# Altium schematic sheet Analog.SchDoc
size A3
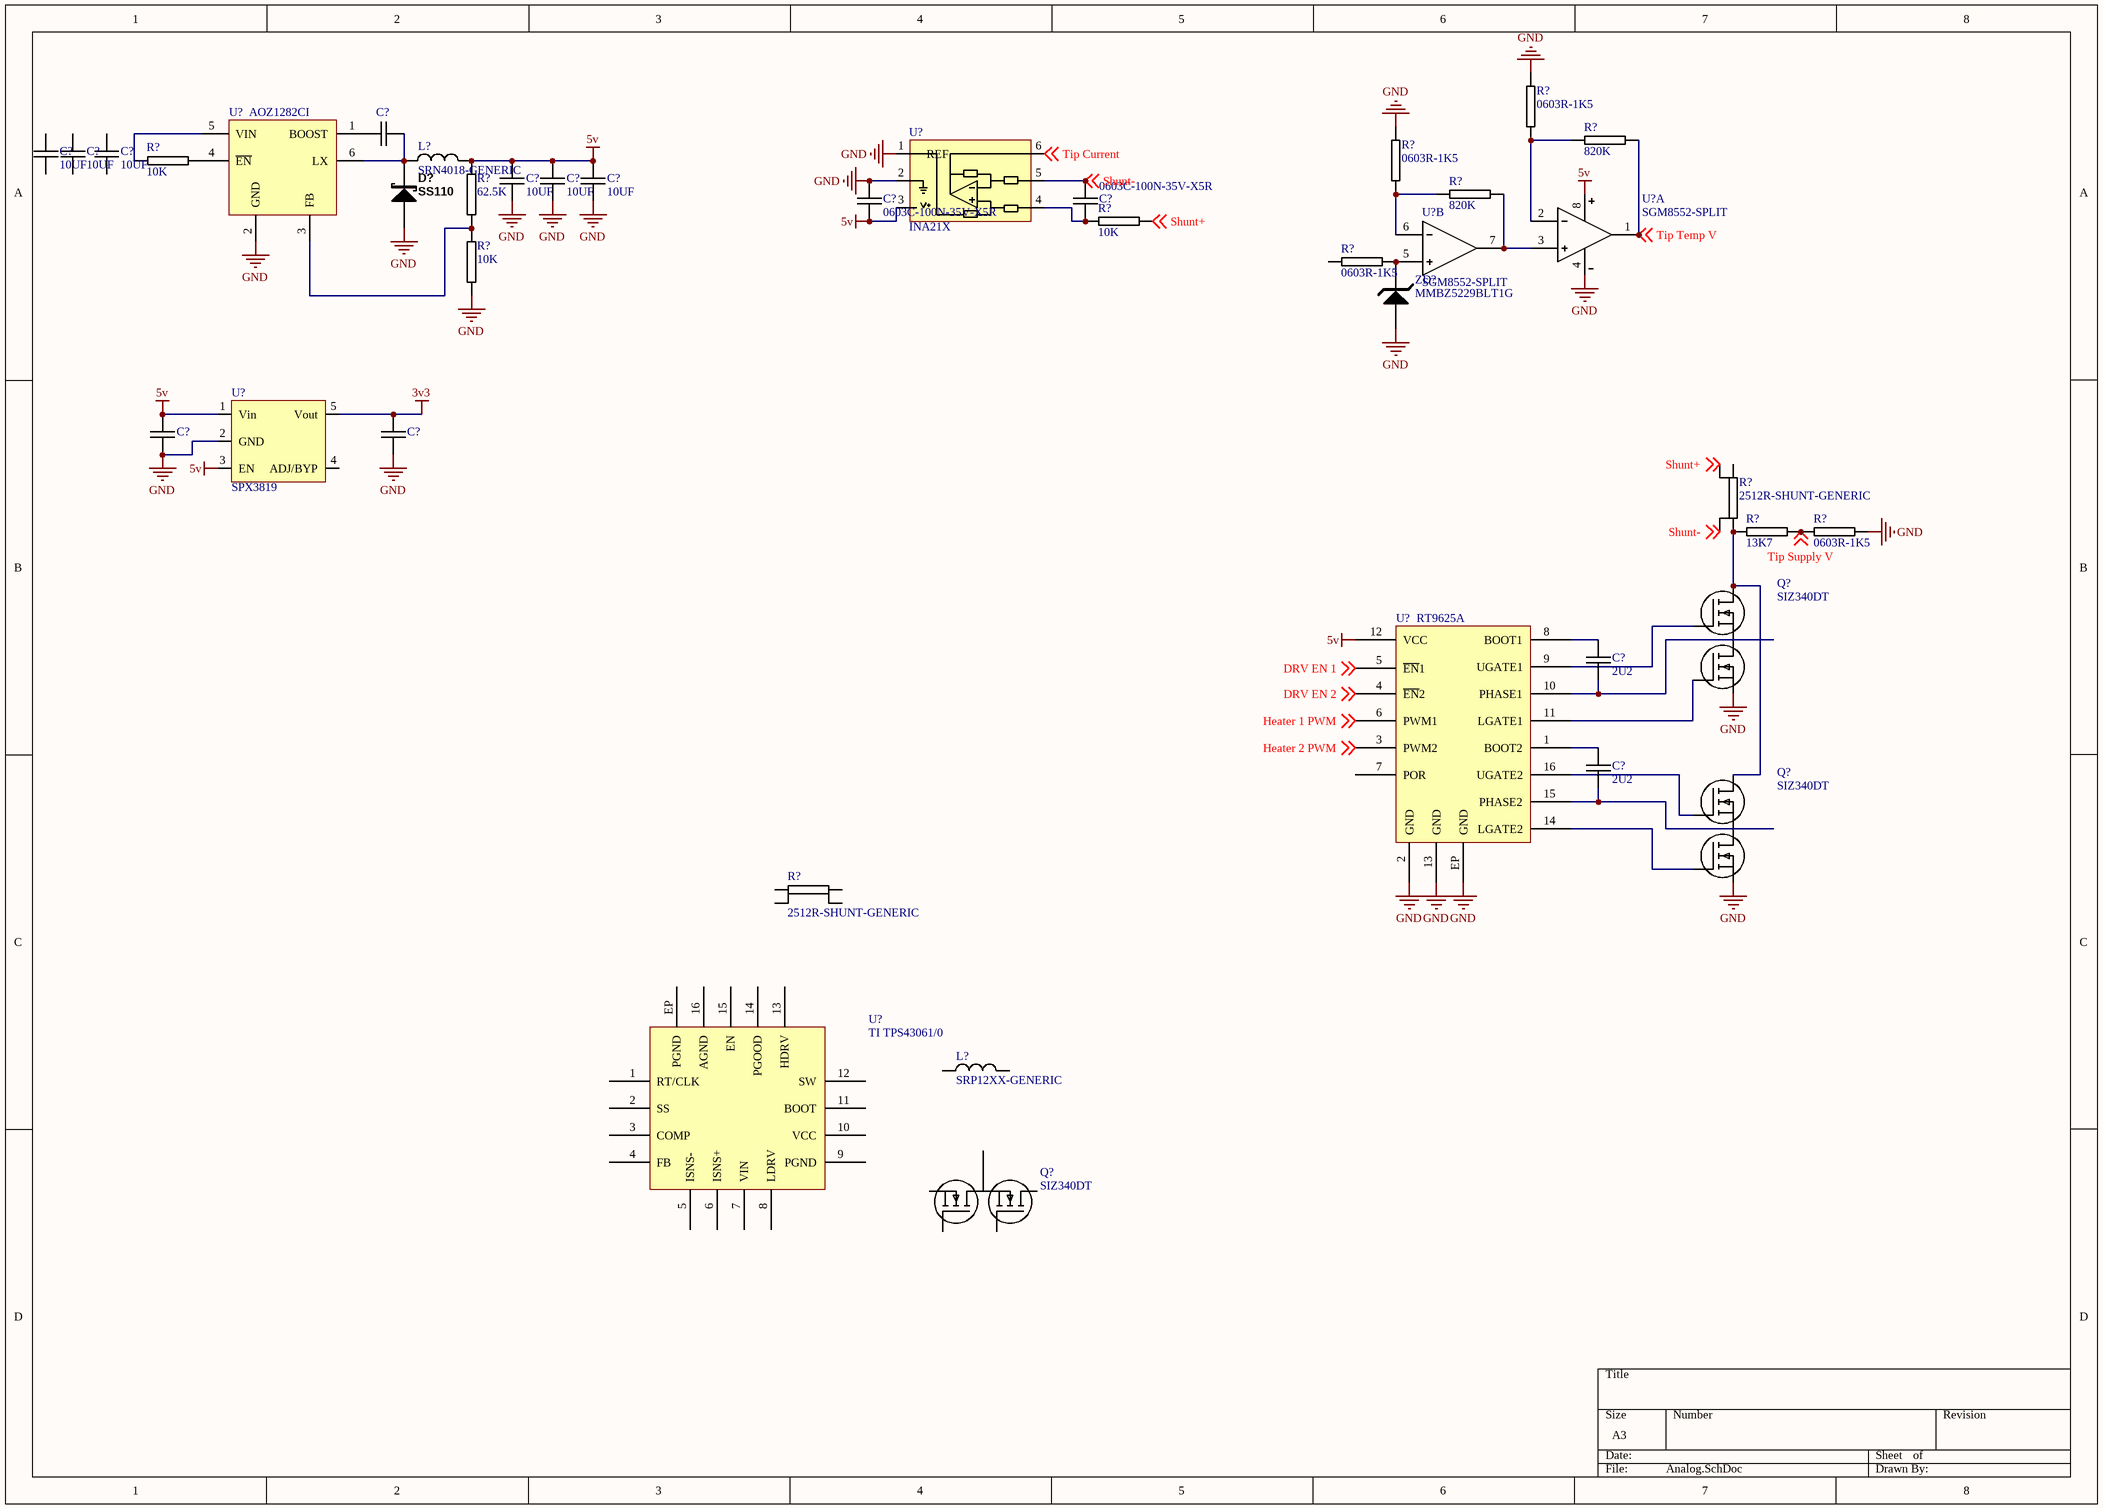
[diagram p0: Analog.SchDoc]

## Parts
(Parts that share a designator on the sheet are numbered #1, #2 ... from top to bottom, then left to right.)
C?#1  10UF  [1206C-GENERIC]
C?#2  10UF  [1206C-GENERIC]
C?#3  10UF  [1206C-GENERIC]
C?#4  0603C-100N-35V-X5R  [0603C-GENERIC]  (value not drawn)
C?#5  10UF  [1206C-GENERIC]
C?#6  10UF  [1206C-GENERIC]
C?#7  10UF  [1206C-GENERIC]
C?#8  0603C-100N-35V-X5R  [0603C-GENERIC]
C?#9  0603C-100N-35V-X5R  [0603C-GENERIC]
C?#10  0603C-100N-35V-X5R  [0603C-GENERIC]  (value not drawn)
C?#11  0603C-100N-35V-X5R  [0603C-GENERIC]  (value not drawn)
C?#12  2U2  [1206C-GENERIC]
C?#13  2U2  [1206C-GENERIC]
D?  SS110  [DIODE-SMA]
L?#1  SRN4018-GENERIC  [SRN4018]
L?#2  SRP12XX-GENERIC  [SRP1250]
Q?#1  SIZ340DT  [PowerPAIR  3 x 3]
Q?#2  SIZ340DT  [PowerPAIR  3 x 3]
Q?#3  SIZ340DT  [PowerPAIR  3 x 3]
R?#1  0603R-1K5  [0603R-1k5]
R?#2  0603R-1K5  [0603R-1k5]
R?#3  820K  [0603R-GENERIC]
R?#4  10K  [0603R-10K]
R?#5  62.5K  [0603R-68K]
R?#6  820K  [0603R-GENERIC]
R?#7  10K  [0603R-10K]
R?#8  0603R-1K5  [0603R-1k5]
R?#9  10K  [0603R-10K]
R?#10  2512R-SHUNT-GENERIC  [2512R-SHUNT]  (net tie, no BOM)
R?#11  13K7  [0603R-GENERIC]
R?#12  0603R-1K5  [0603R-1k5]
R?#13  2512R-SHUNT-GENERIC  [2512R-SHUNT]  (net tie, no BOM)
U?#1  AOZ1282CI  [SOT23-6]
U?#2  INA21X  [SC70-6]
U?#3  SGM8552-SPLIT  [MSOP8]  (part A of 2)
U?#4  SGM8552-SPLIT  [MSOP8]  (part B of 2)
U?#5  SPX3819  [SOT-23-5]
U?#6  RT9625A  [WQFN-16L 4x4 0.65mm]
U?#7  TI TPS43061/0  [S-PWQFN-N16]
ZD?  MMBZ5229BLT1G  [SOT23-DIODE]

## Nets
3v3: C?#11.2 U?#5.5(Vout)
5v: C?#5.1 C?#6.1 C?#7.1 C?#8.2 C?#10.2 L?#1.2 R?#5.1 U?#2.3(V+) U?#3.8(Vs+) U?#5.1(Vin) U?#5.3(EN) U?#6.12(VCC)
GND: C?#5.2 C?#6.2 C?#7.2 C?#8.1 C?#10.1 C?#11.1 D?.A Q?#1.S2 Q?#2.S2 R?#1.1 R?#2.1 R?#9.1 R?#12.2 U?#1.2(GND) U?#2.1(REF) U?#2.2(GND) U?#3.4(Vs-) U?#5.2(GND) U?#6.2(GND) U?#6.13(GND) U?#6.EP(GND) ZD?.A
DRV EN 1: U?#6.5(~{EN}1) ; off-sheet DRV EN 1
DRV EN 2: U?#6.4(~{EN}2) ; off-sheet DRV EN 2
Heater 1 PWM: U?#6.6(PWM1) ; off-sheet Heater 1 PWM
Heater 2 PWM: U?#6.3(PWM2) ; off-sheet Heater 2 PWM
Shunt+: R?#7.2 R?#10.4 ; off-sheet Shunt+
Shunt-: C?#9.1 R?#10.3 U?#2.5(IN-) ; off-sheet Shunt-
Tip Current: U?#2.6(OUT) ; off-sheet Tip Current
Tip Supply V: R?#11.2 R?#12.1 ; off-sheet Tip Supply V
Tip Temp V: R?#3.2 U?#3.1 ; off-sheet Tip Temp V
NetC?#4_1: C?#4.1 U?#1.1(BOOST)
NetC?#4_2: C?#4.2 D?.K L?#1.1 U?#1.6(LX)
NetC?#9_2: C?#9.2 R?#7.1 U?#2.4(IN+)
NetC?#12_1: C?#12.1 Q?#1.D2S1 U?#6.10(PHASE1)
NetC?#12_2: C?#12.2 U?#6.8(BOOT1)
NetC?#13_1: C?#13.1 Q?#2.D2S1 U?#6.15(PHASE2)
NetC?#13_2: C?#13.2 U?#6.1(BOOT2)
NetQ?#1_D1: Q?#1.D1 Q?#2.D1 R?#10.1 R?#11.1
NetQ?#1_G1: Q?#1.G1 U?#6.9(UGATE1)
NetQ?#1_G2: Q?#1.G2 U?#6.11(LGATE1)
NetQ?#2_G1: Q?#2.G1 U?#6.16(UGATE2)
NetQ?#2_G2: Q?#2.G2 U?#6.14(LGATE2)
NetR?#1_2: R?#1.2 R?#3.1 U?#3.2
NetR?#2_2: R?#2.2 R?#6.1 U?#4.6
NetR?#4_1: R?#4.1 U?#1.5(VIN)
NetR?#4_2: R?#4.2 U?#1.4(~{EN})
NetR?#5_2: R?#5.2 R?#9.2 U?#1.3(FB)
NetR?#6_2: R?#6.2 U?#3.3 U?#4.7
NetR?#8_2: R?#8.2 U?#4.5 ZD?.K

Not connected (* = marked no-connect by the designer): C?#1 1 2; C?#2 1 2; C?#3 1 2; L?#2 1 2; Q?#3 D1 D2S1 G1 G2 S2; R?#8 1; R?#10 2; R?#13 1 2 3 4; U?#5 4(ADJ/BYP); U?#6 7(POR); U?#7 1(RT/CLK) 2(SS) 3(COMP) 4(FB) 5(ISNS-) 6(ISNS+) 7(VIN) 8(LDRV) 9(PGND) 10(VCC) 11(BOOT) 12(SW) 13(HDRV) 14(PGOOD) 15(EN) 16(AGND) EP(PGND)

## Library data of the parts
C?#1-C?#3 C?#5-C?#7 = 1206C-10U-35V-X7R: GENERIC CAPACITOR NON POLARISED 1206; Manufacturer Part Number: GMK316F106ZL-T; Manufacturer: Taiyo Yuden; Reel: C90; Supplier 1: Digi-Key; Supplier Part Number 1: 587-1352-2-ND
C?#4 C?#8-C?#11 = 0603C-100N-35V-X5R: CAPACITOR 0603 CERAMIC
C?#12 C?#13 = 1206C-2U2-50V: CAPACITOR 1206 CERAMIC
D? = SS110: Schottky Diode SMA/DO-214AC
L?#1 = SRN4018-GENERIC: BOURNS SRN4018 Series Inductor
L?#2 = SRP12XX-GENERIC: BOURNS SRP12XX Series Inductor
Q?#1-Q?#3 = SIZ340DT: Dual N Channel MOSFET
R?#1 R?#2 R?#8 R?#12 = 0603R-1K5: GENERIC RESISTOR 0603; Manufacturer Part Number: RMCF 1/16 15K 1% R; Manufacturer: Stackpole Electronics Inc; Tolerance: ±1%; Resistance In Ohms: 15.0K; Power (Watts): 0.1W, 1/10W; Temperature Coefficient: ±100ppm/°C; Supplier 1: Digi-Key; Supplier Part Number 1: RMCF1/1615KFRTR-ND; Supplier: Digi-Key; Supplier Part Number: RMCF1/1615KFRTR-ND; Packaging: Tape & Reel (TR); Category: Resistors; Case: 0603 (1608 metric); Composition: Thick Film; Lead Style: Surface Mount (SMD - SMT); RoHS: RoHS Compliant
R?#3 R?#6 = 0603R-820K: GENERIC RESISTOR 0603; Manufacturer: Stackpole Electronics Inc; Manufacturer Part Number: RMC 1/16 820K 1% R; Power (Watts): 0.1W, 1/10W; Temperature Coefficient: ±100ppm/°C; Tolerance: ±1%; Supplier 1: Digi-Key; Supplier Part Number 1: RMC1/16820KFR-ND; Case: 0603 (1608 metric); RoHS: RoHS non-compliant; Supplier Part Number: RMC1/16820KFR-ND; Category: Resistors; Composition: Thick Film; Packaging: Tape & Reel (TR); Lead Style: Surface Mount (SMD - SMT); Resistance In Ohms: 820K; Supplier: Digi-Key
R?#4 R?#7 R?#9 = 0603R-10K: GENERIC RESISTOR 0603; Manufacturer: Stackpole Electronics Inc; Manufacturer Part Number: RMCF 1/16 10K 1% R; Tolerance: ±1%; Power (Watts): 0.1W, 1/10W; Temperature Coefficient: ±100ppm/°C; Resistance In Ohms: 10.0K; Reel: R21; Category: Resistors; Supplier Part Number: RMCF1/1610KFRDKR-ND; Lead Style: Surface Mount (SMD - SMT); RoHS: RoHS Compliant; Packaging: Digi-Reel®; Case: 0603 (1608 metric); Composition: Thick Film; Supplier: Digi-Key; Supplier 1: Digi-Key; Supplier Part Number 1: RMCF0603FT10K0DKR-ND
R?#5 = 0603R-68K: GENERIC RESISTOR 0603
R?#10 R?#13 = 2512R-SHUNT-GENERIC: GENERIC SHUNT RESISTOR 2512; Reel: *
R?#11 = 0603R-13K7: GENERIC RESISTOR 0603; Supplier 1: Digi-Key; Supplier Part Number 1: RMCF0603FT13K7-ND
U?#1 = AOZ1282CI: 1.2A 36V Buck Regulator SOT-23-6
U?#2 = INA21X: Current Shunt Amplifier
U?#3 U?#4 = SGM8552-SPLIT: IC DUAL PRECISION OPAMP
U?#5 = SPX3819: SOT23-5 3v3
U?#6 = RT9625A: 24V Dual Half Bridge Driver
U?#7 = TI TPS43061/0: Synchronous Boost Converter
ZD? = MMBZ5229BLT1G: 4.3v Zener Diode